# Altium schematic sheet CPU.SchDoc
size Tabloid
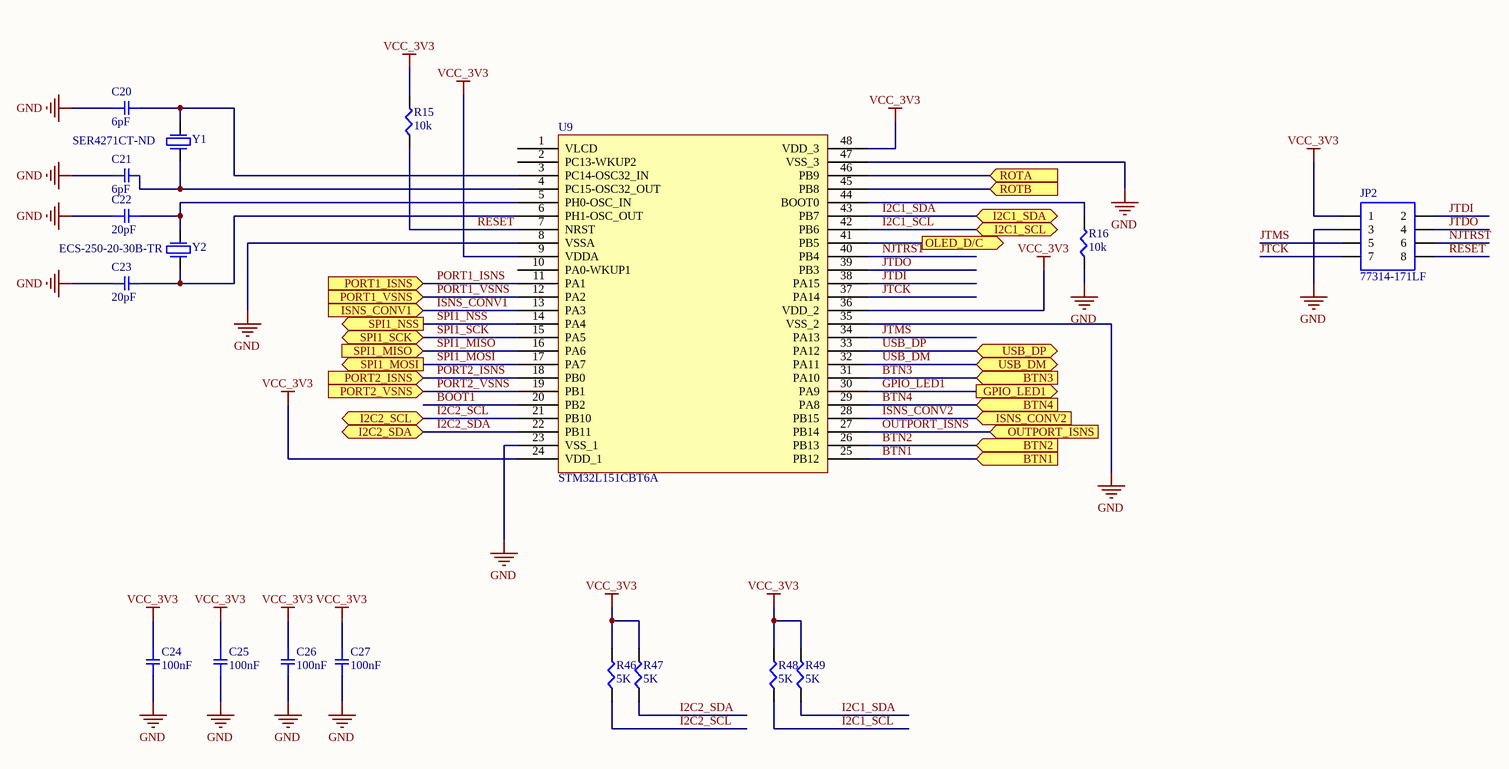
[diagram p0: CPU.SchDoc]

## Parts
C20  6pF  [SMD-0805C]
C21  6pF  [SMD-0805C]
C22  20pF  [SMD-0805C]
C23  20pF  [SMD-0805C]
C24  100nF  [SMD-0805C]
C25  100nF  [SMD-0805C]
C26  100nF  [SMD-0805C]
C27  100nF  [SMD-0805C]
JP2  77314-171LF  [2x4 Pin Header]
R15  10k  [SMD-0603-RES]
R16  10k  [SMD-0603-RES]
R46  5K  [SMD-0603-RES]
R47  5K  [SMD-0603-RES]
R48  5K  [SMD-0603-RES]
R49  5K  [SMD-0603-RES]
U9  STM32L151CBT6A  [LQFP_151CBT6A_STM]
Y1  SER4271CT-ND  [ABS07-120]
Y2  ECS-250-20-30B-TR  [4-SMD XTAL]

## Ports
BTN1 (in), BTN2 (in), BTN3 (in), BTN4 (in), GPIO_LED1 (out), I2C1_SCL (bidir), I2C1_SDA (bidir), I2C2_SCL (bidir), I2C2_SDA (bidir), ISNS_CONV1 (in), ISNS_CONV2 (in), OLED_D/C (out), OUTPORT_ISNS (in), PORT1_ISNS (in), PORT1_VSNS (in), PORT2_ISNS (in), PORT2_VSNS (in), ROTA (in), ROTB (in), SPI1_MISO (in), SPI1_MOSI (out), SPI1_NSS (out), SPI1_SCK (bidir), USB_DM (bidir), USB_DP (bidir)

## Nets
GND: C20.1 C21.1 C22.1 C23.1 C24.2 C25.2 C26.2 C27.2 JP2.3 R16.1 U9.8(VSSA) U9.23(VSS_1) U9.35(VSS_2) U9.47(VSS_3)
VCC_3V3: C24.1 C25.1 C26.1 C27.1 JP2.1 R15.2 R46.2 R47.2 R48.2 R49.2 U9.9(VDDA) U9.24(VDD_1) U9.36(VDD_2) U9.48(VDD_3)
BOOT1: U9.20(PB2)
BTN1: U9.25(PB12) ; port BTN1
BTN2: U9.26(PB13) ; port BTN2
BTN3: U9.31(PA10) ; port BTN3
BTN4: U9.29(PA8) ; port BTN4
GPIO_LED1: U9.30(PA9) ; port GPIO_LED1
I2C1_SCL: R48.1 U9.42(PB6) ; port I2C1_SCL
I2C1_SDA: R49.1 U9.43(PB7) ; port I2C1_SDA
I2C2_SCL: R46.1 U9.21(PB10) ; port I2C2_SCL
I2C2_SDA: R47.1 U9.22(PB11) ; port I2C2_SDA
ISNS_CONV1: U9.13(PA3) ; port ISNS_CONV1
ISNS_CONV2: U9.28(PB15) ; port ISNS_CONV2
JTCK: JP2.7 U9.37(PA14)
JTDI: JP2.2 U9.38(PA15)
JTDO: JP2.4 U9.39(PB3)
JTMS: JP2.5 U9.34(PA13)
NJTRST: JP2.6 U9.40(PB4)
OLED_D/C: U9.41(PB5) ; port OLED_D/C
OUTPORT_ISNS: U9.27(PB14) ; port OUTPORT_ISNS
PORT1_ISNS: U9.11(PA1) ; port PORT1_ISNS
PORT1_VSNS: U9.12(PA2) ; port PORT1_VSNS
PORT2_ISNS: U9.18(PB0) ; port PORT2_ISNS
PORT2_VSNS: U9.19(PB1) ; port PORT2_VSNS
RESET: JP2.8 R15.1 U9.7(NRST)
ROTA: U9.46(PB9) ; port ROTA
ROTB: U9.45(PB8) ; port ROTB
SPI1_MISO: U9.16(PA6) ; port SPI1_MISO
SPI1_MOSI: U9.17(PA7) ; port SPI1_MOSI
SPI1_NSS: U9.14(PA4) ; port SPI1_NSS
SPI1_SCK: U9.15(PA5) ; port SPI1_SCK
USB_DM: U9.32(PA11) ; port USB_DM
USB_DP: U9.33(PA12) ; port USB_DP
NetC20_2: C20.2 U9.3(PC14-OSC32_IN) Y1.1
NetC21_2: C21.2 U9.4(PC15-OSC32_OUT) Y1.2
NetC22_2: C22.2 U9.5(PH0-OSC_IN) Y2.1
NetC23_2: C23.2 U9.6(PH1-OSC_OUT) Y2.3
NetR16_2: R16.2 U9.44(BOOT0)

Not connected (* = marked no-connect by the designer): U9 1(VLCD) 2(PC13-WKUP2) 10(PA0-WKUP1)

## Library data of the parts
C20-C27 = GCM21BR71H104KA37L: CAP CER 0.1UF 50V X7R 0805; Manufacturer: Murata Electronics North America; Factory Stock: 0; Unit Price (USD): 0.12; Minimum Quantity: 1; Value: 0.10µF; Tolerance: ±10%; Datasheets: http://www.murata.com/~/media/webrenewal/support/library/catalog/products/capacitor/mlcc/c03e.ashx; Image: //media.digikey.com/photos/Murata%20Photos/NCP,GCM%20SERIES%200805.jpg; Digi-Key Part Number: 490-6064-1-ND; Part Number: GCM21BR71H104KA37L; Quantity Available: 76325; @ qty: 0; Packaging: Cut Tape (CT); Series: GCM; Part Status: Active; Voltage: 50V; Temperature Coefficient: X7R; Operating Temperature: -55°C ~ 125°C; Features: -; Ratings: AEC-Q200; Applications: Automotive; Mounting Type: Surface Mount, MLCC; Package / Case: 0805 (2012 Metric); Size / Dimension: 0.079" L x 0.049" W (2.00mm x 1.25mm); Height - Seated (Max): -; Thickness (Max): 0.055" (1.40mm); Lead Spacing: -; Lead Style: -
JP2 = CONN HEADER VERT 2x4: CONN HEADER VERT 8POS 2.54MM
R15 R16 = ERJ-3BQF1R6V: RES SMD 1.6 OHM 1% 1/4W 0603; Manufacturer: Panasonic Electronic Components; Factory Stock: 0; Unit Price (USD): 0.05386; @ qty: 1500; Minimum Quantity: 1; Value: 1.6; Power (Watts): 0.25W, 1/4W; Temperature Coefficient: ±200ppm/°C; Part Number: ERJ-3BQF1R6V; Datasheets: https://industrial.panasonic.com/cdbs/www-data/pdf/RDA0000/AOA0000C239.pdf; Image: //media.digikey.com/Photos/Panasonic%20Photos/MFG_ERJ-P6W%20Series.jpg; Digi-Key Part Number: P17375CT-ND; Quantity Available: 1850; Packaging: Cut Tape (CT); Series: ERJ; Part Status: Active; Tolerance: ±1%; Composition: Thick Film; Features: Automotive AEC-Q200, Current Sense; Operating Temperature: -55°C ~ 125°C; Package / Case: 0603 (1608 Metric); Supplier Device Package: 0603; Size / Dimension: 0.063" L x 0.031" W (1.60mm x 0.80mm); Height - Seated (Max): 0.022" (0.55mm); Number of Terminations: 2; Failure Rate: -
R46-R49 = ERJ-3BQF1R5V: RES SMD 1.5 OHM 1% 1/4W 0603; Manufacturer: Panasonic Electronic Components; Factory Stock: 0; Unit Price (USD): 0.06115; @ qty: 1500; Minimum Quantity: 1; Value: 1.5; Power (Watts): 0.25W, 1/4W; Temperature Coefficient: ±200ppm/°C; Part Number: ERJ-3BQF1R5V; Datasheets: https://industrial.panasonic.com/cdbs/www-data/pdf/RDA0000/AOA0000C239.pdf; Image: //media.digikey.com/Photos/Panasonic%20Photos/MFG_ERJ-P6W%20Series.jpg; Digi-Key Part Number: P15988CT-ND; Quantity Available: 1591; Packaging: Cut Tape (CT); Series: ERJ; Part Status: Active; Tolerance: ±1%; Composition: Thick Film; Features: Automotive AEC-Q200, Current Sense; Operating Temperature: -55°C ~ 125°C; Package / Case: 0603 (1608 Metric); Supplier Device Package: 0603; Size / Dimension: 0.063" L x 0.031" W (1.60mm x 0.80mm); Height - Seated (Max): 0.022" (0.55mm); Number of Terminations: 2; Failure Rate: -
U9 = IC STM32L151CBT6A_1: No Description Available; Vendor: STMicroelectronics; Built_By: EMA_Matt; SourceLibrary: Add_to_database_2021-03-16; Datasheet: https://www.mouser.com/datasheet/2/389/dm00078689-1797705.pdf; Copyright: Copyright (C) 2018 Accelerated Designs. All rights reserved; Manufacturer_Part_Number: STM32L151CBT6A; RefDes: RefDes; Type: DEV
Y1 = CRYSTAL 32.7680KHZ: 32.768kHz ±20ppm Crystal 6pF 55 kOhms 2-SMD, No Lead
Y2 = CRYSTAL 20MHZ: CRYSTAL 20MHZ 18PF SMD